# Altium project tx_board.PrjPcb
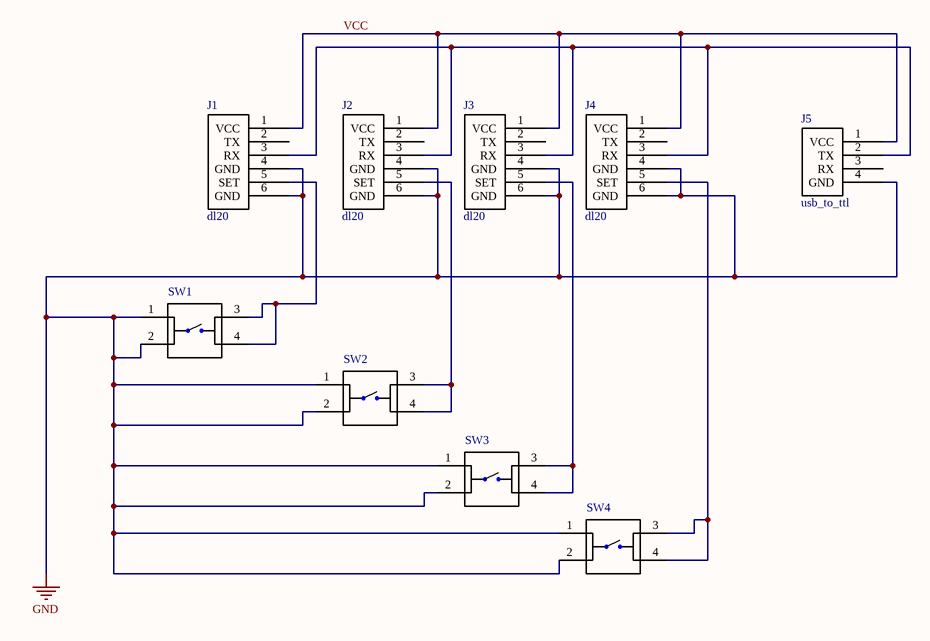
[diagram p0: tx_board.SchDoc]
1 sheet, 9 parts. Net scope: global (net labels, ports and power ports of the same name join across sheets).
Board file: tx_board.PcbDoc

## Sheet tx_board.SchDoc
size A

### Parts
J1  dl20  [DL20]
J2  dl20  [DL20]
J3  dl20  [DL20]
J4  dl20  [DL20]
J5  usb_to_ttl  [USB_TO_TTL]
SW1  1825910-6  [*SW_1825910-6-4]  (value not drawn)
SW2  1825910-6  [*SW_1825910-6-4]  (value not drawn)
SW3  1825910-6  [*SW_1825910-6-4]  (value not drawn)
SW4  1825910-6  [*SW_1825910-6-4]  (value not drawn)

### Nets
GND: J1.4(GND) J1.6(GND) J2.4(GND) J2.6(GND) J3.4(GND) J3.6(GND) J4.4(GND) J4.6(GND) J5.4(GND) SW1.1 SW1.2 SW2.1 SW2.2 SW3.1 SW3.2 SW4.1 SW4.2
VCC: J1.1(VCC) J2.1(VCC) J3.1(VCC) J4.1(VCC) J5.1(VCC)
NetJ1_3: J1.3(RX) J2.3(RX) J3.3(RX) J4.3(RX) J5.2(TX)
NetJ1_5: J1.5(SET) SW1.3 SW1.4
NetJ2_5: J2.5(SET) SW2.3 SW2.4
NetJ3_5: J3.5(SET) SW3.3 SW3.4
NetJ4_5: J4.5(SET) SW4.3 SW4.4

Not connected (* = marked no-connect by the designer): J1 2(TX); J2 2(TX); J3 2(TX); J4 2(TX); J5 3(RX)

### Library data of the parts
SW1-SW4 = 1825910-6: FSM4JH=6MM TACT SWITCH, HIGH TEMP; Contact_Current_Rating: 50 mA; Configuration_Pole-Throw: Single Pole - Single Throw; MF: TE Connectivity; TE_purchase_URL: https://www.te.com/usa-en/product-1825910-6.html?te_bu=Cor&te_type=disp&te_campaign=seda_glo_cor-seda-global-disp-prtnr-fy19-seda-model-bom-cta_sma-317_1&elqCampaignId=32493; MP: 1825910-6; EU_RoHS_Compliance: Compliant; Digi-Key_Purchase_URL: https://www.digikey.com/product-detail/en/te-connectivity-alcoswitch-switches/1825910-6/450-1650-ND/1632536?utm_source=snapeda&utm_medium=aggregator&utm_campaign=symbol; Package: None; SnapEDA_Link: https://www.snapeda.com/parts/1825910-6/TE%20Connectivity%20ALCOSWITCH%20Switches/view-part/?ref=snap; Digi-Key_Part_Number: 450-1650-ND; Value: *